# Altium schematic sheet Main.SchDoc
size A; SheetNumber: 1; SheetTotal: 4
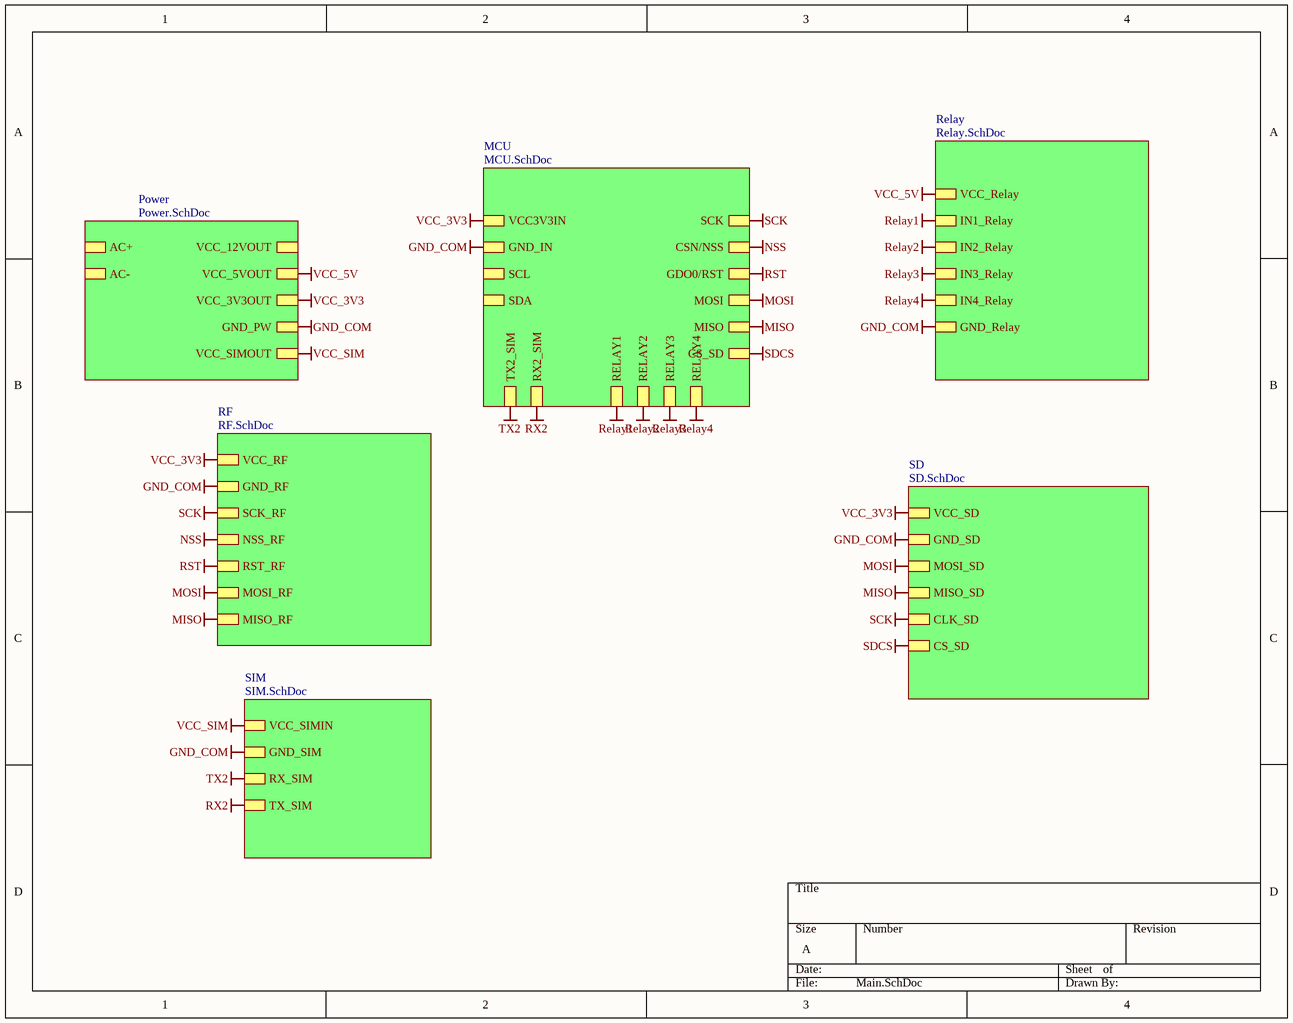
[diagram p0: Main.SchDoc]

## Sub-sheets
MCU = MCU.SchDoc: TX2_SIM, RX2_SIM, SCK, CSN/NSS, GDO0/RST, MOSI, MISO, RELAY1, RELAY2, RELAY3, RELAY4, CS_SD, VCC3V3IN, GND_IN, SCL, SDA
Power = Power.SchDoc: VCC_12VOUT, VCC_5VOUT, VCC_3V3OUT, GND_PW, VCC_SIMOUT, AC+, AC-
Relay = Relay.SchDoc: VCC_Relay, IN1_Relay, IN2_Relay, IN3_Relay, IN4_Relay, GND_Relay
RF = RF.SchDoc: VCC_RF, GND_RF, SCK_RF, RST_RF, NSS_RF, MOSI_RF, MISO_RF
SD = SD.SchDoc: GND_SD, MOSI_SD, MISO_SD, CLK_SD, CS_SD, VCC_SD
SIM = SIM.SchDoc: VCC_SIMIN, GND_SIM, RX_SIM, TX_SIM

## Nets
GND_COM: sheet MCU/GND_IN, sheet Relay/GND_Relay, sheet Power/GND_PW, sheet SIM/GND_SIM, sheet RF/GND_RF, sheet SD/GND_SD
MISO: sheet MCU/MISO, sheet RF/MISO_RF, sheet SD/MISO_SD
MOSI: sheet MCU/MOSI, sheet RF/MOSI_RF, sheet SD/MOSI_SD
NSS: sheet MCU/CSN/NSS, sheet RF/NSS_RF
Relay1: sheet MCU/RELAY1, sheet Relay/IN1_Relay
Relay2: sheet MCU/RELAY2, sheet Relay/IN2_Relay
Relay3: sheet MCU/RELAY3, sheet Relay/IN3_Relay
Relay4: sheet MCU/RELAY4, sheet Relay/IN4_Relay
RST: sheet MCU/GDO0/RST, sheet RF/RST_RF
RX2: sheet MCU/RX2_SIM, sheet SIM/TX_SIM
SCK: sheet MCU/SCK, sheet RF/SCK_RF, sheet SD/CLK_SD
SDCS: sheet MCU/CS_SD, sheet SD/CS_SD
TX2: sheet MCU/TX2_SIM, sheet SIM/RX_SIM
VCC_3V3: sheet MCU/VCC3V3IN, sheet Power/VCC_3V3OUT, sheet RF/VCC_RF, sheet SD/VCC_SD
VCC_5V: sheet Relay/VCC_Relay, sheet Power/VCC_5VOUT
VCC_SIM: sheet Power/VCC_SIMOUT, sheet SIM/VCC_SIMIN